# EAGLE design laser_driver (EAGLE 9.1.3)
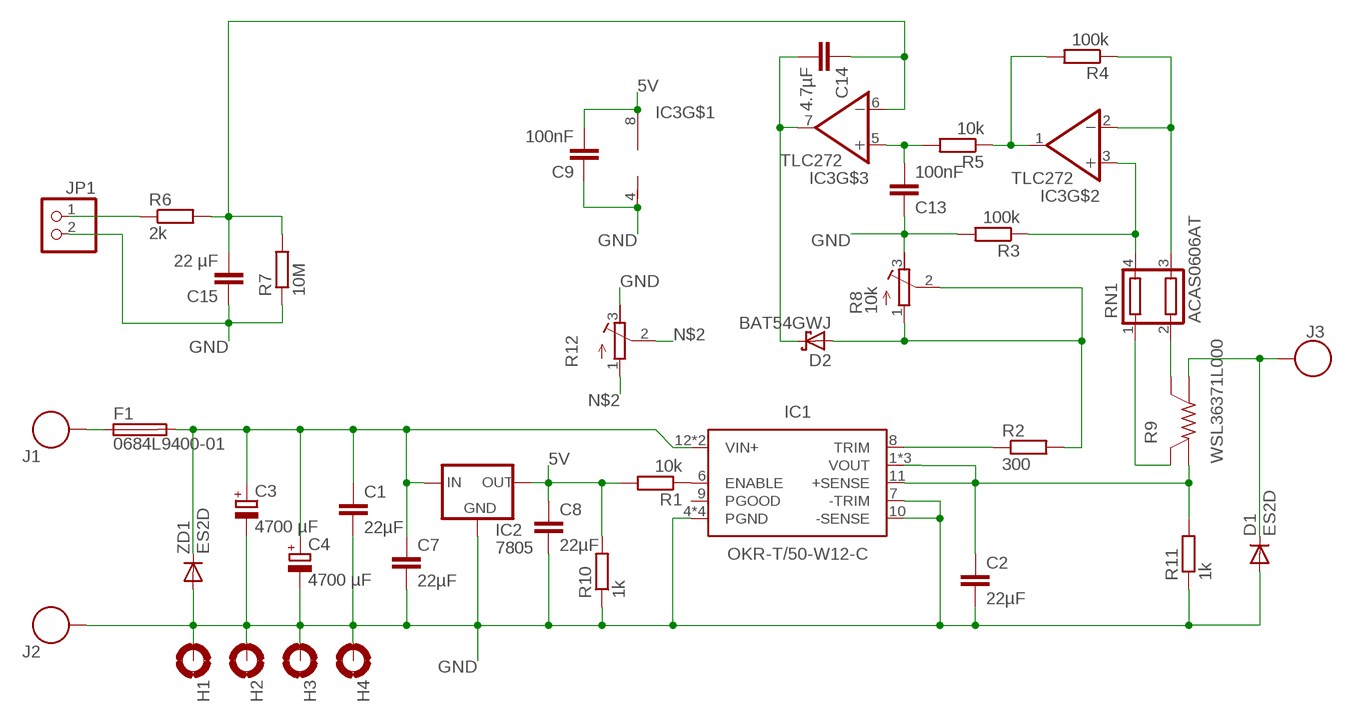
[diagram p0: schematic, sheet 1]

## Parts
C1  22µF  C-EUC0805  [C0805]
C2  22µF  C-EUC0805  [C0805]
C3  4700 µF  CPOL-EUE7.5-16  [E7,5-16]
C4  4700 µF  CPOL-EUE7.5-16  [E7,5-16]
C7  22µF  C-EUC0805  [C0805]
C8  22µF  C-EUC0805  [C0805]
C9  100nF  C-EUC0805  [C0805]
C13  100nF  C-EUC0805  [C0805]
C14  4.7µF  C-EUC0805  [C0805]
C15  22 µF  C-EUC0805  [C0805]
D1  ES2D  [SMB]
D2  BAT54GWJ  [SOD-123_MINI-SMA]
F1  0684L9400-01  [4818]
H1  MOUNT-PAD-ROUND3.0  [3,0-PAD]
H2  MOUNT-PAD-ROUND3.0  [3,0-PAD]
H3  MOUNT-PAD-ROUND3.0  [3,0-PAD]
H4  MOUNT-PAD-ROUND3.0  [3,0-PAD]
IC1  OKR-T/50-W12-C  [OKR-T/50-W12-C]
IC2  7805  78XX  [TO252]
IC3  TLC272  [SO08]
J1  74650073R  [FBGA90-6X15]
J2  74650073R  [FBGA90-6X15]
J3  74650073R  [FBGA90-6X15]
JP1  PINHD-1X2  [1X02]
R1  10k  R-EU_R0805  [R0805]
R2  300  R-EU_R0805  [R0805]
R3  100k  R-EU_R0805  [R0805]
R4  100k  R-EU_R0805  [R0805]
R5  10k  R-EU_R0805  [R0805]
R6  2k  R-EU_R0805  [R0805]
R7  10M  R-EU_R0805  [R0805]
R8  10k  R-TRIMM64Y  [RTRIM64Y]
R9  WSL36371L000  WSL3637  [WSL3637]
R10  1k  R-EU_R0805  [R0805]
R11  1k  R-EU_R0805  [R0805]
R12  R-TRIMM4G/J  [RTRIM4G/J]
RN1  ACAS0606AT  [RESCAXS80P160X150X45-4]
ZD1  ES2D  [SMB]

## Nets
5V: C8.1 C9.2 IC2.2(OUT) IC3.8(V+) R1.2 R10.2
CV: JP1.1 R6.1
ENABLE: IC1.6(ENABLE) R1.1
GND: C1.2 C2.2 C3.- C4.- C7.2 C8.2 C9.1 C13.1 C15.1 D1.A H1.B3,0(MOUNT) H2.B3,0(MOUNT) H3.B3,0(MOUNT) H4.B3,0(MOUNT) IC1.4(PGND) IC1.5(PGND) IC1.7(-TRIM) IC1.10(-SENSE) IC1.14(PGND) IC1.15(PGND) IC2.3(GND) IC3.4(V-) J2.P$1 J2.P$2 J2.P$3 J2.P$4 JP1.2 R3.2 R7.1 R8.3(E) R10.1 R11.1 R12.3(E) ZD1.A
N$1: D1.C J3.P$1 J3.P$2 J3.P$3 J3.P$4 R9.I1(A)
N$2: D2.A R2.2 R8.1(A) R8.2(S) R12.1(A) R12.2(S)
N$4: C2.1 IC1.1(VOUT) IC1.2(VOUT) IC1.3(VOUT) IC1.11(+SENSE) R9.I2(B) R11.2
N$5: F1.1 J1.P$1 J1.P$2 J1.P$3 J1.P$4
N$12: R9.V1(SA) RN1.2
N$13: IC3.3(+IN) R3.1 RN1.4
N$40: R9.V2(SB) RN1.1
N$118: IC3.2(-IN) R4.1 RN1.3
N$119: IC3.1(OUT) R4.2 R5.1
N$298: C13.2 IC3.5(+IN) R5.2
N$299: C14.2 D2.C IC3.7(OUT)
N$301: C14.1 C15.2 IC3.6(-IN) R6.2 R7.2
TRIM: IC1.8(TRIM) R2.1
VIN: C1.1 C3.+ C4.+ C7.1 F1.2 IC1.12(VIN+) IC1.13(VIN+) IC2.1(IN) ZD1.C
Unconnected: IC1.9(PGOOD)

## Library data of the parts
C1 C2 C7-C9 C13-C15 = rcl:C-EU: CAPACITOR, European symbol; SPICEPREFIX: C
C3 C4 = resistor:CPOL-EU: POLARIZED CAPACITOR, European symbol
D1 ZD1 = diode:ES2D: DIODE super fast rectifier, 2 A
D2 = my:BAT54GWJ
F1 = bel fuse:0684L9400-01
H1-H4 = holes:MOUNT-PAD-ROUND: MOUNTING PAD, round
IC1 = OKR-T-50-W12-C:OKR-T/50-W12-C
IC2 = smd_vreg:78XX
IC3 = my:TLC272
J1-J3 = REDCUBE:74650073R
JP1 = pinhead:PINHD-1X2: PIN HEADER
R1 = resistor:R-EU_: RESISTOR, European symbol
R2-R7 R10 R11 = rcl:R-EU_: RESISTOR, European symbol; SPICEPREFIX: R
R8 R12 = rcl:R-TRIMM: Trimm resistor; SPICEMODEL: X; SPICEPREFIXL: POT
R9 = reesistor-shunt:WSL3637
RN1 = my:ACAS0606AT

## Board
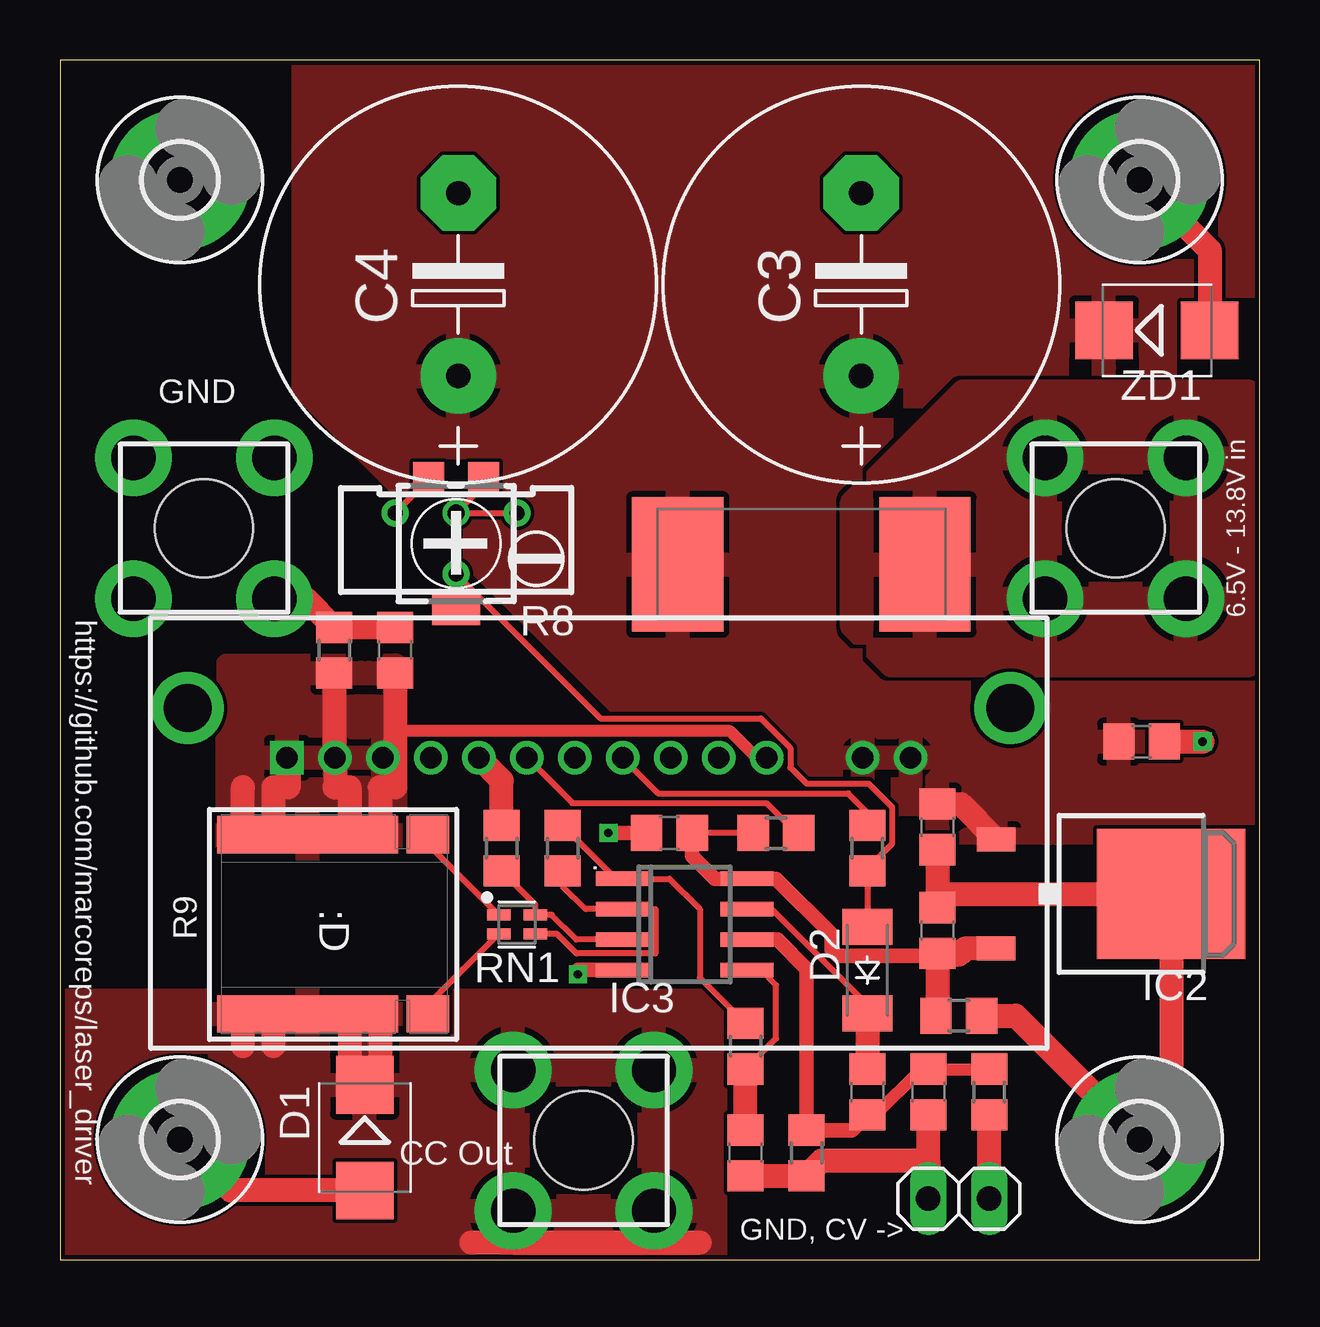
[diagram p1: board, top side]
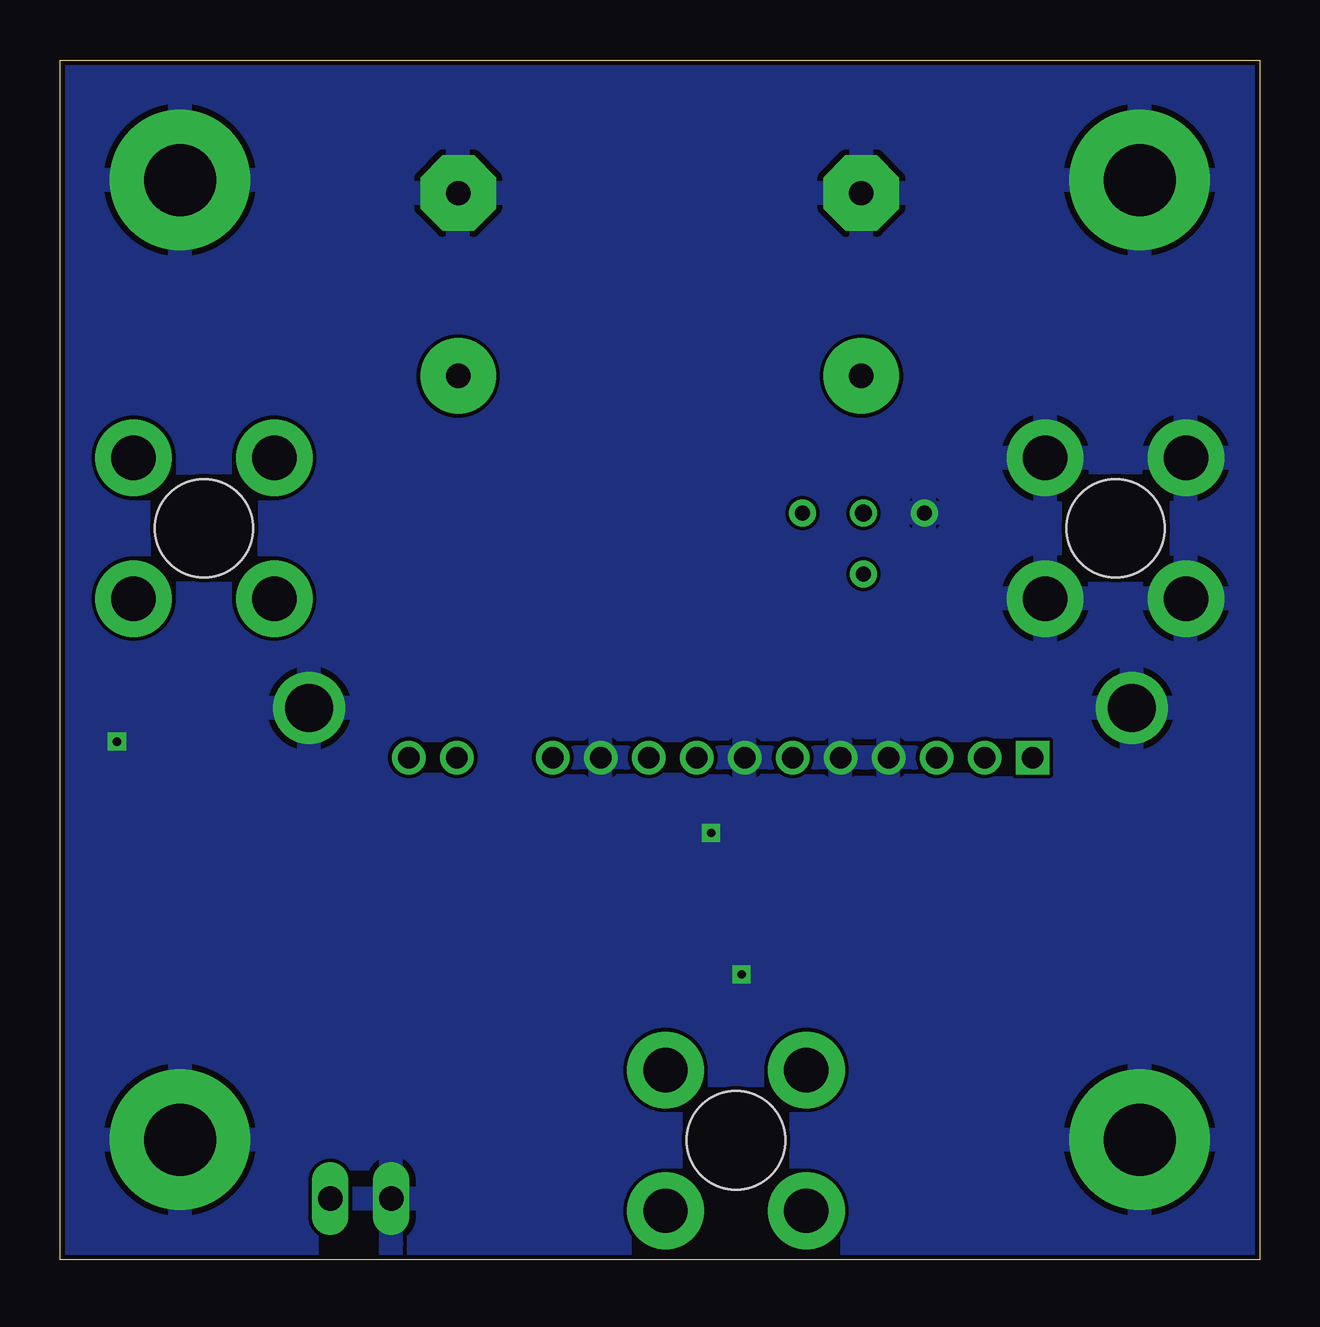
[diagram p2: board, bottom side, seen from below]

Size 50 x 50 mm. Coordinates in mm from the lower left corner, seen from the top.
Outline: 0,0 50,0 50,50 0,50 0,0
Copper layers (1*16): Top 0.035mm / dielectric 1.5mm / Bottom 0.035mm
Design rules "default *": minimum track width 6mil, minimum drill 0.35mm, track to track 6mil, track to pad 6mil, pad to pad 6mil, via to via 6mil, smd to smd 0mil, copper to edge 0.2mm, drill to drill 6mil, minimum pad ring 10mil, minimum via ring 8mil, stop-mask expansion 4mil, vias tented up to drill 0mil, thermal gap 10mil
tRestrict: area 1.9,1.9 to 8.1,8.1; area 41.9,41.9 to 48.1,48.1

### Footprints (pad centres in the part's own frame; a part is rotated, then mirrored left to right if it is on the bottom)
C0805 = smd 1.3 x 1.5: 1 -0.95,0; 2 0.95,0
E7,5-16 = drill 1.016 pad 3.15: + -3.81,0 | drill 1.016 pad 3.15 octagon: - 3.81,0
SMB = smd 2.4 x 2.4: A 2.2,0; C -2.2,0
SOD-123_MINI-SMA = smd 1.5 x 2.1: A 1.8,0; C -1.8,0
4818 = smd 3.8 x 5.6: 1 -5.15,0; 2 5.15,0
3,0-PAD = drill 3 pad 5.842: B3,0 0,0
OKR-T/50-W12-C = drill 0.9 square: 1 -13,3.14 | drill 0.9: 2 -11,3.14; 3 -9,3.14; 4 -7,3.14; 5 -5,3.14; 6 -3,3.14; 7 -1,3.14; 8 1,3.14; 9 3,3.14; 10 5,3.14; 11 7,3.14; 12 11,3.14; 13 13,3.14 | drill 2: 14 -17.145,5.2; 15 17.145,5.2
TO252 = smd 1 x 1.6: 1 -2.28,-4.8; 2 2.28,-4.8 | smd 5.4 x 6.2: 3 0,2.5
SO08 = smd 0.6 x 2.2: 1 -1.905,-2.6; 2 -0.635,-2.6; 3 0.635,-2.6; 4 1.905,-2.6; 5 1.905,2.6; 6 0.635,2.6; 7 -0.635,2.6; 8 -1.905,2.6
FBGA90-6X15 = drill 1.85 pad 3.2: P$1 -2.935,2.935; P$2 2.935,2.935; P$3 2.935,-2.935; P$4 -2.935,-2.935 | hole 4.1: 0,0
1X02 = drill 1.016 long: 1 -1.27,0; 2 1.27,0
R0805 = smd 1.3 x 1.5: 1 -0.95,0; 2 0.95,0
RTRIM64Y = drill 0.61: 1 0,-2.54; 2 -2.54,0; 3 0,2.54
WSL3637 = smd 7.547 x 1.55: I1 -1.1,-3.735; I2 -1.1,3.735 | smd 1.78 x 1.55: V1 3.9,-3.735; V2 3.9,3.735
RTRIM4G/J = smd 1.3 x 1.3: 1 -1.15,-2.75; 3 1.15,-2.75 | smd 2 x 1.3: 2 0,2.75
RESCAXS80P160X150X45-4 = smd 0.992 x 0.46: 1 -0.76,0.4; 2 -0.76,-0.4; 3 0.76,-0.4; 4 0.76,0.4

### Placement (x,y rotation side)
C1  45.09,21.59 0 top
C2  13.97,25.4 90 top
C3  33.4,40.64 90 top
C4  16.6,40.64 90 top
C7  36.58,18.03 270 top
C8  36.58,13.72 90 top
C9  25.4,17.78 0 top
C13  28.57,4.45 90 top
C14  33.66,6.99 90 top
C15  36.2,6.99 90 top
D1  12.7,5.08 270 top
D2  33.66,12.06 90 top
F1  30.9,28.97 180 top
H1  5,5 0 top
H2  5,45 0 top
H3  45,45 0 top
H4  45,5 0 top
IC1  22.46,17.78 0 top
IC2  43.81,15.24 270 top
IC3  26.04,13.97 270 top
J1  44,30.48 270 top
J2  6,30.48 0 top
J3  21.82,4.96 90 top
JP1  37.47,2.54 180 top
R1  29.84,17.78 180 top
R2  33.66,17.14 270 top
R3  18.41,17.14 90 top
R4  20.95,17.14 90 top
R5  28.57,8.89 270 top
R6  38.73,6.99 90 top
R7  31.11,4.45 90 top
R8  16.51,31.11 90 top
R9  11.43,13.97 0 top
R10  37.47,10.16 180 top
R11  11.43,25.4 270 top
R12  16.51,29.84 180 top
RN1  19.05,13.97 0 top
ZD1  45.72,38.73 0 top

### Tracks (layer width: path | path; a pad name or v marks a point on that pad's centre or on a via)
5V
  Top 0.254: R1.2 C9.2
  Top 0.6: C9.2 26.35,16.83 27.3,15.88 IC3.8 29.84,15.88 32.15,13.57 32.15,12.93 32.42,12.66 36.47,12.66 C8.1
  Top 1: IC2.2 37.73,12.96 37.47,12.7 36.64,12.7 C8.1 36.58,10.22 R10.2
CV
  Top 1: JP1.1 R6.1
ENABLE
  Top 0.254: IC1.6 21.36,19.02 29.45,19.02 30.69,17.78 R1.1
GND  (via drill 0.35)
  Top 0.254: R8.3 15.36,32.51 R12.3
  Top 0.6: IC3.4 21.59,12.06 v21.59,11.89 | C9.1 v22.86,17.78
  Top 1: C7.2 36.58,15.88 36.58,15.24 | 36.58,15.24 IC2.3 46.31,6.32 H4.B3,0 39.84,10.16 R10.1 | C13.1 R7.1 31.75,4.13 36.2,4.13 JP1.2 C15.1 | R3.2 18.41,19.96 IC1.5 | C2.2 R11.1 10.23,27.55 J2.P$3 | H3.B3,0 47.92,42.08 ZD1.A | D1.A 7.12,2.88 H1.B3,0 | C1.2 v47.62,21.59 | 36.58,15.24 C8.2
  pour Bottom: 0,0 50.16,0 50.16,50.16 0,50.16
N$1
  Top 1: 13.34,7.62 13.34,10.23 R9.I1 | R9.I1 12.06,10.23 12.06,8.26 | R9.I1 10.33,10.16 | 10.33,10.16 8.89,10.16 8.89,8.89 | R9.I1 10.33,10.16 | 10.33,10.16 7.62,10.16 7.62,8.89 | J3.P$1 18.89,0.7 26.67,0.7 17.14,0.7
  pour Top: 0,0 0,10.79 27.3,10.79 27.3,0
N$2  (via drill 0.7)
  Top 0.254: D2.A R2.2 33.66,16.3 34.68,17.33 34.68,18.86 33.71,19.84 31.11,19.84 30.44,20.51 30.44,21.33 29.21,22.56 22.53,22.56 R8.2 | R8.2 v16.51,31.11 | v16.51,31.11 R8.1 | R8.2 R12.2 | v16.51,31.11 17.66,32.27 R12.1
N$4
  Top 0.5: IC1.11 29.02,20.92 27.92,22.03 14.17,22.03 13.97,22.23
  Top 1: 11.46,24.42 R11.2 11.43,20.95 IC1.2 11.46,19.71 11.43,19.68 12.06,19.68 12.06,17.78 | C2.1 13.97,22.23 13.97,19.68 13.34,19.68 13.34,17.78 | IC1.1 9.53,20.86 9.53,19.68 8.89,19.68 8.89,17.78 7.62,17.78 7.62,19.68 | R9.I2 10.33,17.78 R9.I2
  pour Top: 6.99,17.14 6.99,24.77 13.97,24.77 13.97,17.14
N$5
  pour Top: 33.02,31.56 37.66,36.2 49.53,36.2 49.53,24.77 34.66,24.77 33.02,26.4
N$12
  Top 0.254: RN1.2 15.33,10.61 R9.V1
N$13
  Top 0.254: IC3.3 21.53,13.34 20.5,14.37 RN1.4 19.81,14.8 R3.1
N$40
  Top 0.254: RN1.1 15.33,17.33 R9.V2
N$118
  Top 0.254: RN1.3 20.72,13.57 21.53,12.76 24.81,12.76 24.81,14.61 IC3.2 | 24.13,14.61 IC3.2 | IC3.2 21.91,14.61 20.95,15.56 R4.1
N$119
  Top 0.254: R4.2 23.18,15.88 IC3.1 25.4,15.88 26.67,14.61 26.67,11.74 R5.1
N$298
  Top 0.254: R5.2 29.84,9.21 29.84,11.43 29.21,12.06 IC3.5
  Top 1: C13.2 R5.2
N$299
  Top 0.254: D2.C 33.66,10.61 29.66,14.61 IC3.7
  Top 1: D2.C C14.2
N$301
  Top 0.5: C14.1 33.98,6.04 35.88,7.93 C15.2 R6.2
  Top 0.6: IC3.6 29.91,13.34 31.11,12.12 R7.2 33.02,5.39 C14.1
TRIM
  Top 0.254: IC1.8 23.46,20.89 24.92,19.43 32.84,19.43 33.66,18.62 R2.1
VIN
  Top 1: C7.1 37.55,18.98 IC2.1
  pour Top (rank 2): 10.16,50.16 50.16,50.16 50.16,17.78 28.67,17.78 10.16,36.29

### Text on the board
tNames: GND | 6.5V - 13.8V in | https://github.com/marcoreps/laser_driver | . | :D | CC Out | GND, CV ->
tValues: 40A
200bmp: D:/Desktop/IMG_2449.bmp